# Altium schematic sheet Sheet1.SchDoc
size A4
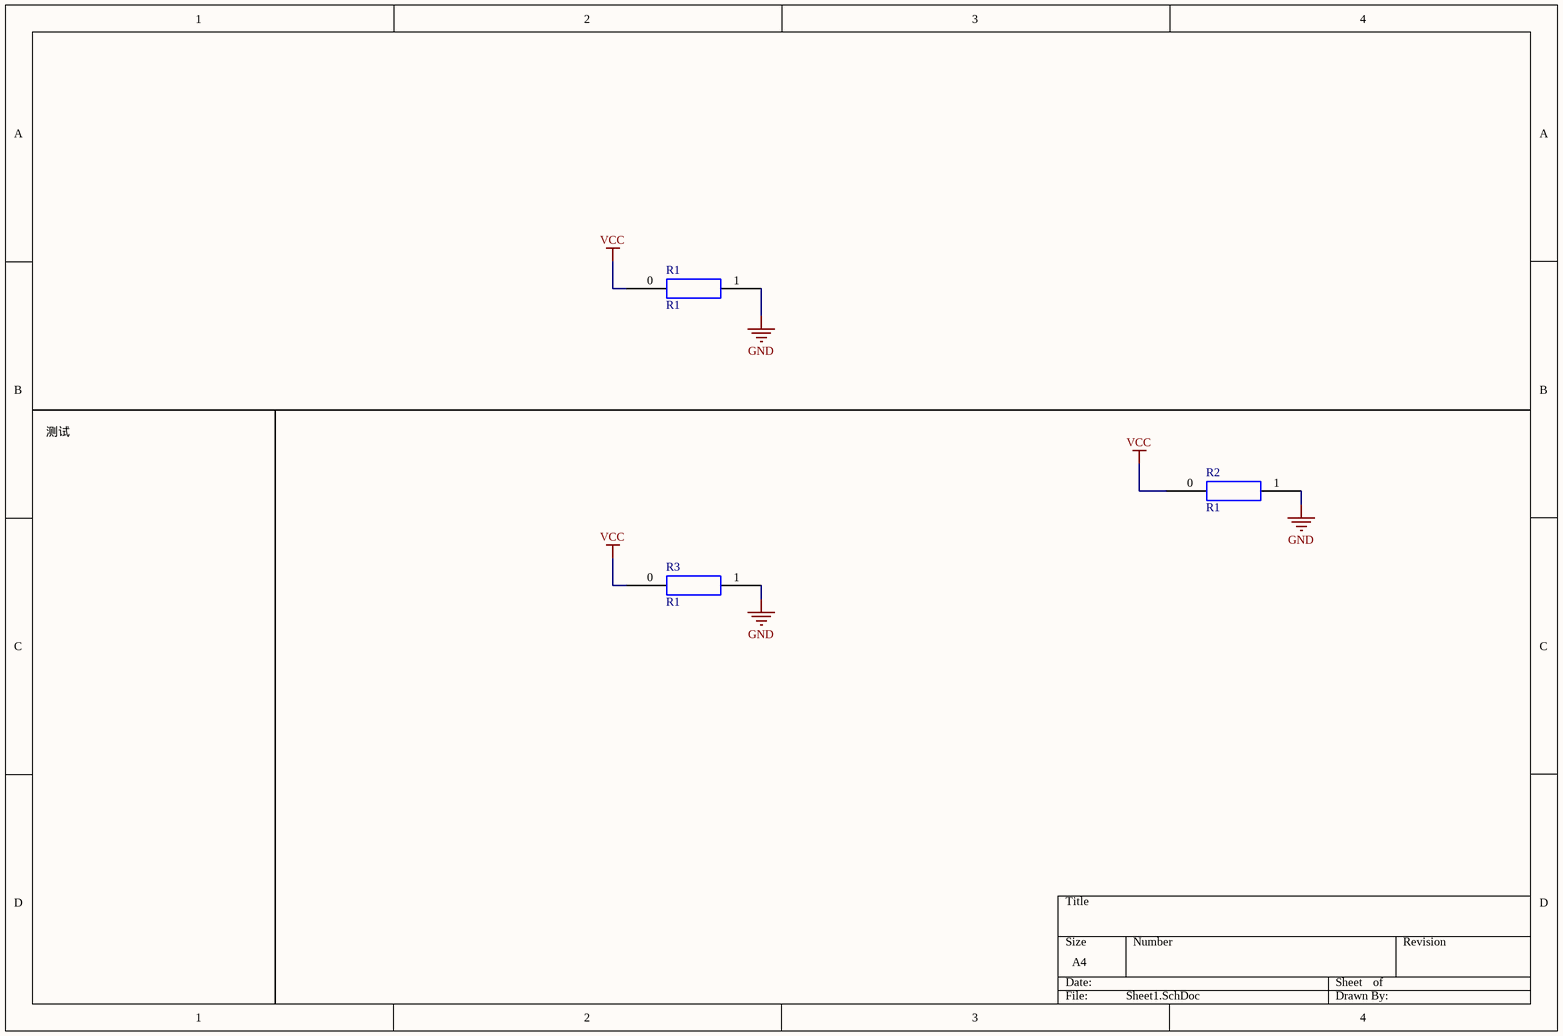
[diagram p0: Sheet1.SchDoc]

## Parts
R1  R1
R2  R1
R3  R1

## Nets
GND: R1.1 R2.1 R3.1
VCC: R1.0 R2.0 R3.0

## Notes on the sheet
- 测试